# Altium project Brightness_Sensor.PrjPcb
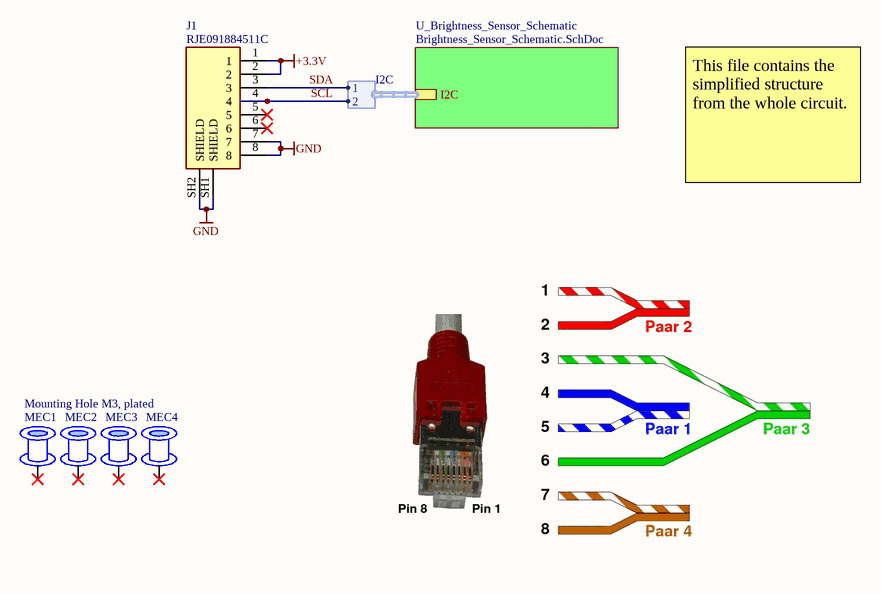
[diagram p0: Blackbox_Brightness_Sensor_Schematic.SchDoc]
Author: Manuel Hueppi; Departement: DBAUG; Institut: IBK; Number: -; Revision: V0.1
2 sheets, 16 parts. Net scope: hierarchical (ports join the sheet entries above them; power ports are global).
Board file: aaa_Empty_PCB_2_Layers.PcbDoc
Sheets:
  Blackbox_Brightness_Sensor_Schematic.SchDoc
    U_Brightness_Sensor_Schematic = Brightness_Sensor_Schematic.SchDoc

## Sheet Blackbox_Brightness_Sensor_Schematic.SchDoc
size A4; DocumentNumber: 1; SheetNumber: 1; SheetTotal: 2

### Parts
J1  RJE091884511C  [RJ45]
MEC1  Mounting Hole M3, plated  [Mounting Hole M3, plated]
MEC2  Mounting Hole M3, plated  [Mounting Hole M3, plated]  (value not drawn)
MEC3  Mounting Hole M3, plated  [Mounting Hole M3, plated]  (value not drawn)
MEC4  Mounting Hole M3, plated  [Mounting Hole M3, plated]  (value not drawn)

### Sub-sheets
U_Brightness_Sensor_Schematic = Brightness_Sensor_Schematic.SchDoc: I2C (harness I2C)

### Harnesses
I2C: 1, 2

### Nets
+3.3V: J1.1 J1.2
GND: J1.7 J1.8 J1.SH1(SHIELD) J1.SH2(SHIELD)
SCL: J1.4 ; sheet U_Brightness_Sensor_Schematic/I2C.2
SDA: J1.3 ; sheet U_Brightness_Sensor_Schematic/I2C.1

Not connected (* = marked no-connect by the designer): J1 5* 6*; MEC1 1*; MEC2 1*; MEC3 1*; MEC4 1*

### Notes on the sheet
- This file contains the simplified structure from the whole circuit.
- Date:
- Title of drawing:
- Time:
- Drawn by:
- Project:
- Revision:
- Institut:
- Departement:
- Page:
- from:
- File:

### Library data of the parts
J1 = RJ45: Jack Modular Connector 8p8c (RJ45, Ethernet) 90Â° Angle (Right) Shielded Cat3.; MF: Amphenol ICC (Commercial Products); SnapEDA_Link: https://www.snapeda.com/parts/RJE091884511C/Amphenol/view-part/?ref=snap; Package: None; Value: *; MP: RJE091884511C; Check_prices: https://www.snapeda.com/parts/RJE091884511C/Amphenol/view-part/?ref=eda; System: Connector
MEC1-MEC4 = Mounting Hole M3, plated: Mounting Hole for M3 Screw, plated to connect signal

## Sheet Brightness_Sensor_Schematic.SchDoc
size A4; DocumentNumber: 6; SheetNumber: 2; SheetTotal: 2
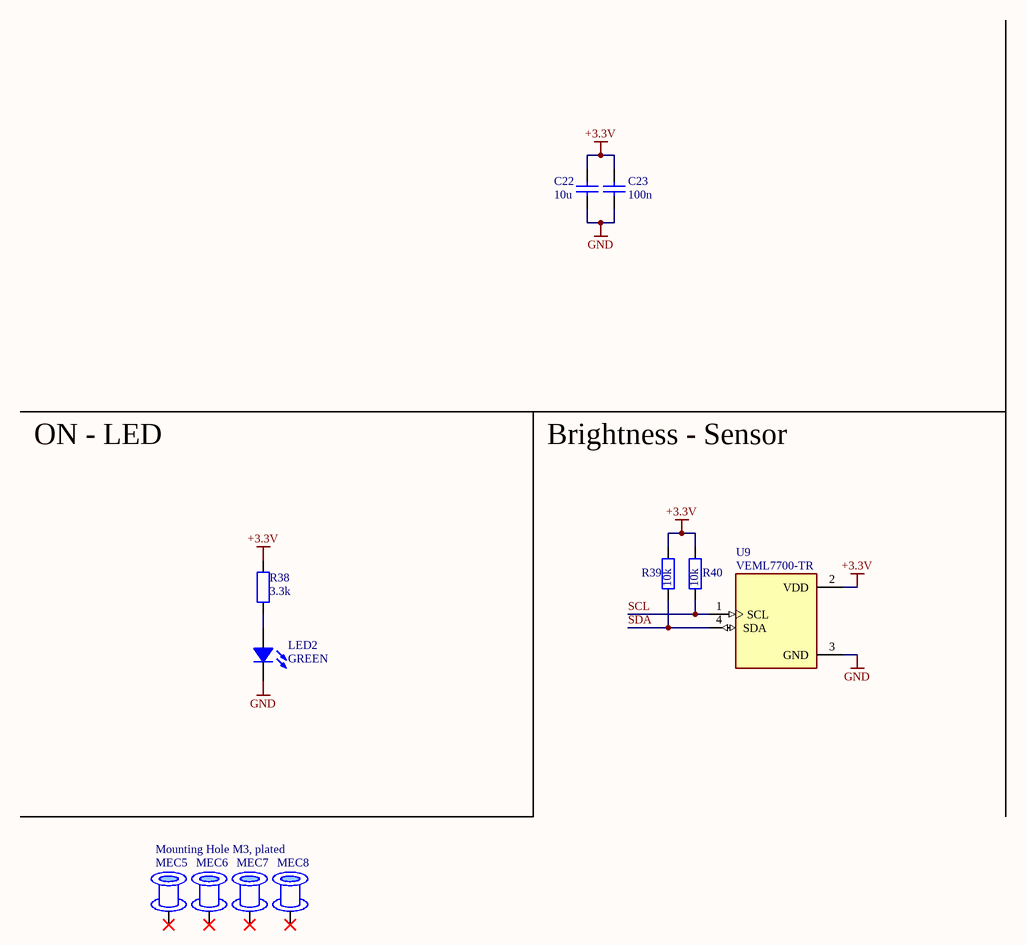
[diagram p1: Brightness_Sensor_Schematic.SchDoc]

### Parts
C22  10u  [0603_CAPACITOR]
C23  100n  [0603_CAPACITOR]
LED2  GREEN  [LED_0603, GREEN]
MEC5  Mounting Hole M3, plated  [Mounting Hole M3, plated]
MEC6  Mounting Hole M3, plated  [Mounting Hole M3, plated]  (value not drawn)
MEC7  Mounting Hole M3, plated  [Mounting Hole M3, plated]  (value not drawn)
MEC8  Mounting Hole M3, plated  [Mounting Hole M3, plated]  (value not drawn)
R38  3.3k  [0603_Resistor]
R39  10k  [0603_Resistor]
R40  10k  [0603_Resistor]
U9  VEML7700-TR  [Brightness_Sensor]

### Nets
+3.3V: C22.2 C23.2 R38.2 R39.2 R40.2 U9.2(VDD)
GND: C22.1 C23.1 LED2.K U9.3(GND)
SCL: R40.1 U9.1(SCL)
SDA: R39.1 U9.4(SDA)
NetLED2_A: LED2.A R38.1

Not connected (* = marked no-connect by the designer): MEC5 1*; MEC6 1*; MEC7 1*; MEC8 1*

### Notes on the sheet
- ON - LED
- Brightness - Sensor
- Date:
- Title of drawing:
- Time:
- Drawn by:
- Project:
- Revision:
- Institut:
- Departement:
- Page:
- from:
- File:

### Library data of the parts
C22 C23 = Capacitor: 0603
LED2 = LED_0603, GREEN: LED 0603, Green, 3.2 V, 20 mA, 430 mcd
MEC5-MEC8 = Mounting Hole M3, plated: as MEC1 on sheet Blackbox_Brightness_Sensor_Schematic
R38-R40 = Resistor: 0603
U9 = Brightness_Sensor: SENSOR OPT 545NMAMB 4 SMD J LEAD.; ComponentLink1Description: Supplier; ComponentLink1URL: https://www.digikey.ch/en/products/detail/vishay-semiconductor-opto-division/VEML7700-TR/5820243

## Nets that join several sheets
+3.3V: Blackbox_Brightness_Sensor_Schematic (J1.1 J1.2), Brightness_Sensor_Schematic (6 pins)
GND: Blackbox_Brightness_Sensor_Schematic (J1.7 J1.8 J1.SH1 J1.SH2), Brightness_Sensor_Schematic (C22.1 C23.1 LED2.K U9.3)

## Assembly variants
Standard-Variant: all parts fitted
All-Components: all parts fitted